# EAGLE design halogen-led (EAGLE 6.5.0)
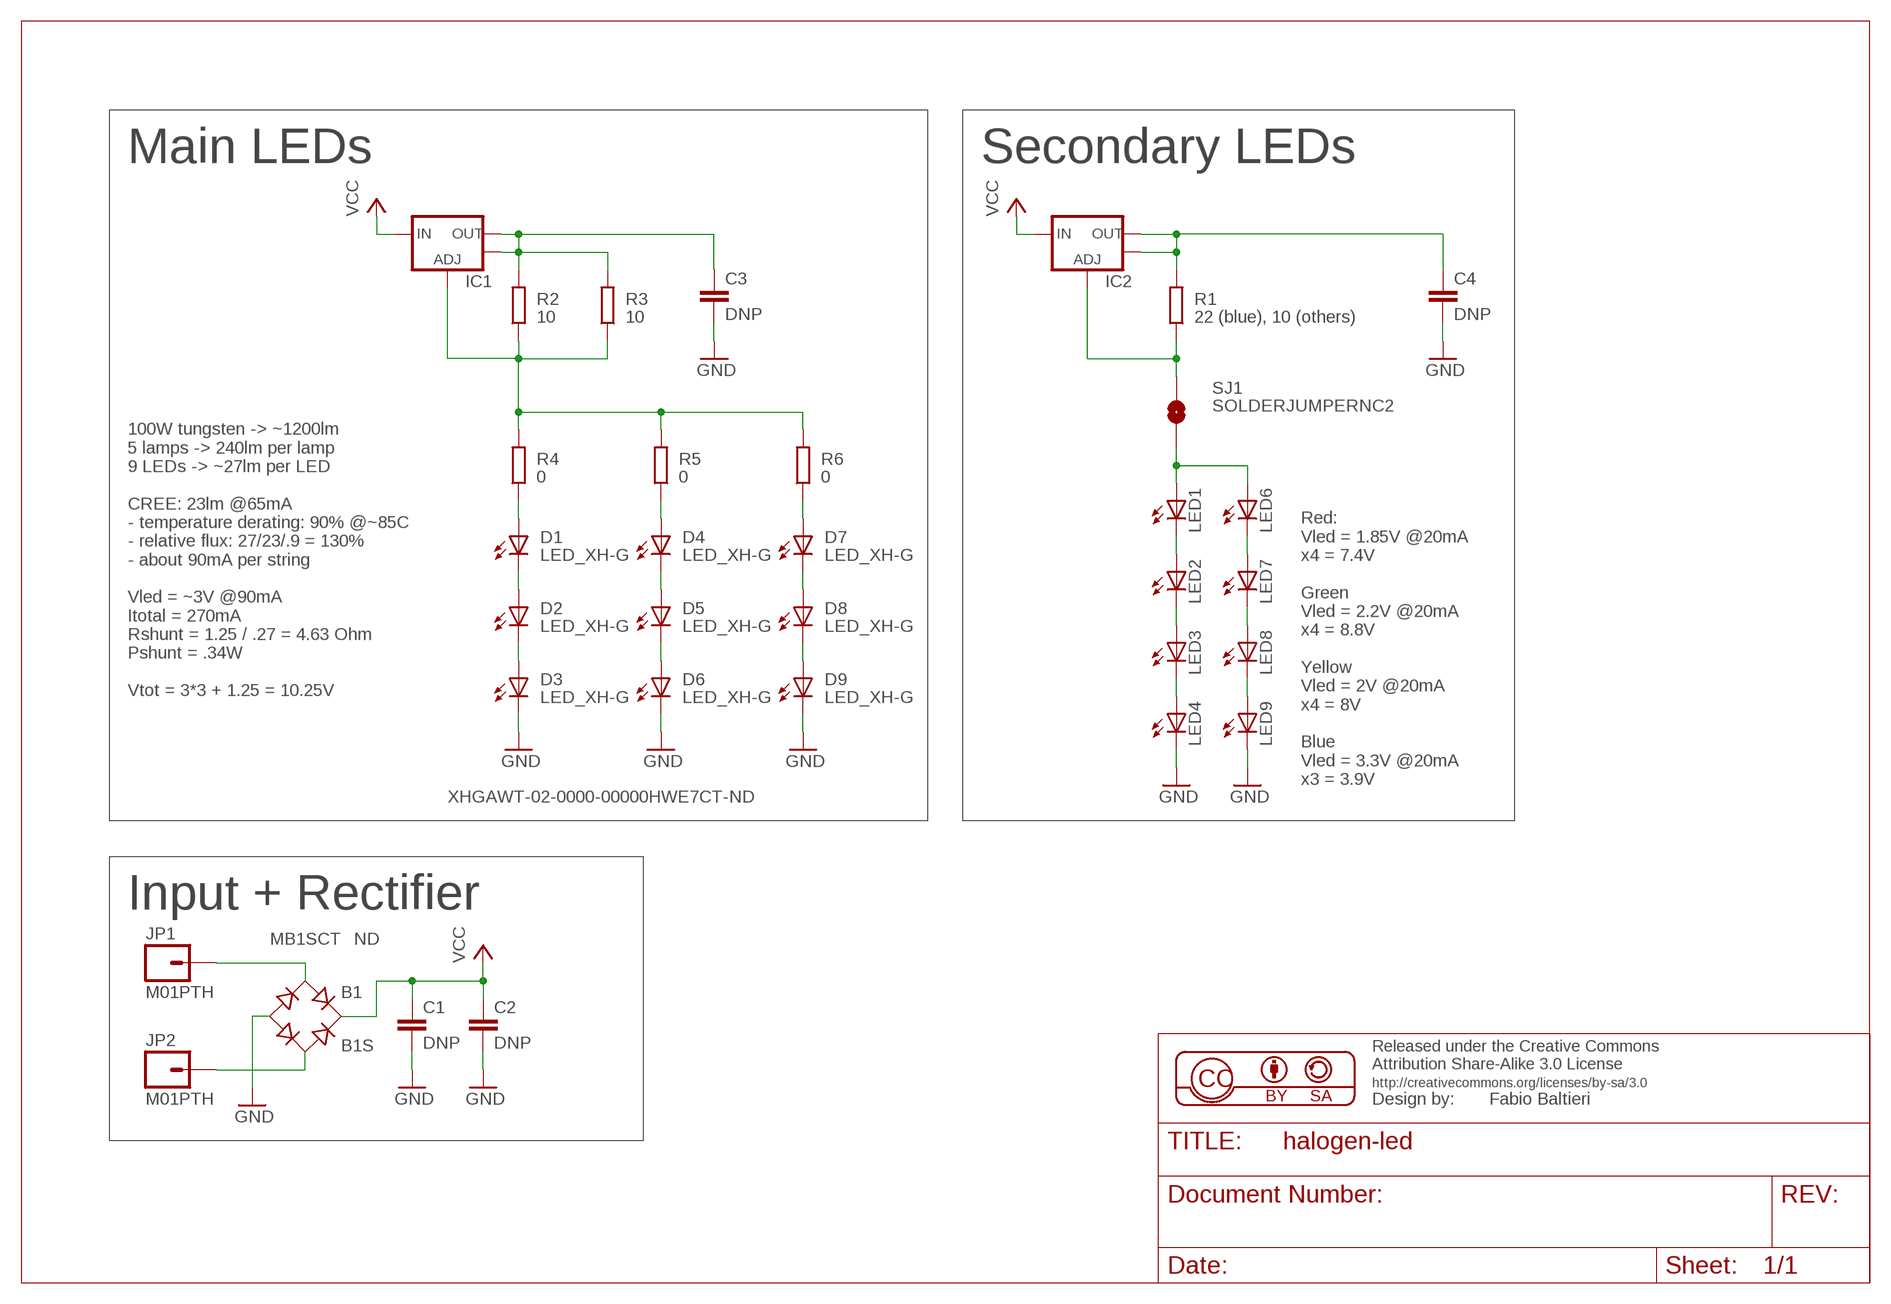
[diagram p0: schematic, sheet 1]

## Parts
B1  B1S  [MBS]
C1  DNP  C-EUC1206  [C1206]
C2  DNP  C-EUC1206  [C1206]
C3  DNP  C-EUC0805  [C0805]
C4  DNP  C-EUC0805  [C0805]
D1  LED_XH-G  [CREE_XHG]
D2  LED_XH-G  [CREE_XHG]
D3  LED_XH-G  [CREE_XHG]
D4  LED_XH-G  [CREE_XHG]
D5  LED_XH-G  [CREE_XHG]
D6  LED_XH-G  [CREE_XHG]
D7  LED_XH-G  [CREE_XHG]
D8  LED_XH-G  [CREE_XHG]
D9  LED_XH-G  [CREE_XHG]
IC1  V_REG_LM1117SOT223  [SOT223]
IC2  V_REG_LM1117SOT223  [SOT223]
JP1  M01PTH  [1X01]
JP2  M01PTH  [1X01]
LED1  LEDCHIPLED_0805  [CHIPLED_0805]
LED2  LEDCHIPLED_0805  [CHIPLED_0805]
LED3  LEDCHIPLED_0805  [CHIPLED_0805]
LED4  LEDCHIPLED_0805  [CHIPLED_0805]
LED6  LEDCHIPLED_0805  [CHIPLED_0805]
LED7  LEDCHIPLED_0805  [CHIPLED_0805]
LED8  LEDCHIPLED_0805  [CHIPLED_0805]
LED9  LEDCHIPLED_0805  [CHIPLED_0805]
R1  22 (blue), 10 (others)  R-EU_R1206  [R1206]
R2  10  R-EU_R1206  [R1206]
R3  10  R-EU_R1206  [R1206]
R4  0  R-EU_R0805  [R0805]
R5  0  R-EU_R0805  [R0805]
R6  0  R-EU_R0805  [R0805]
SJ1  SOLDERJUMPERNC2  [SJ_2S-NOTRACE]

## Nets
GND: B1.- C1.2 C2.2 C3.2 C4.2 D3.C D3.C@1(C) D6.C D6.C@1(C) D9.C D9.C@1(C) LED4.C LED9.C
N$1: B1.AC2 JP2.1
N$2: B1.AC1 JP1.1
N$3: C3.1 IC1.2(OUT) IC1.4(OUT) R2.2 R3.2
N$4: IC1.1(ADJ) R2.1 R3.1 R4.2 R5.2 R6.2
N$5: D1.A D1.A@1(A) R4.1
N$6: D4.A D4.A@1(A) R5.1
N$7: LED3.C LED4.A
N$8: LED2.C LED3.A
N$9: LED1.C LED2.A
N$10: LED1.A LED6.A SJ1.2
N$11: D2.C D2.C@1(C) D3.A D3.A@1(A)
N$12: D1.C D1.C@1(C) D2.A D2.A@1(A)
N$13: D5.C D5.C@1(C) D6.A D6.A@1(A)
N$14: D4.C D4.C@1(C) D5.A D5.A@1(A)
N$15: D8.C D8.C@1(C) D9.A D9.A@1(A)
N$16: C4.1 IC2.2(OUT) IC2.4(OUT) R1.2
N$17: D7.C D7.C@1(C) D8.A D8.A@1(A)
N$18: LED8.C LED9.A
N$19: LED7.C LED8.A
N$20: LED6.C LED7.A
N$21: D7.A D7.A@1(A) R6.1
N$23: IC2.1(ADJ) R1.1 SJ1.1
VCC: B1.+ C1.1 C2.1 IC1.3(IN) IC2.3(IN)

## Notes on the sheet
- Main LEDs | Secondary LEDs
- 100W tungsten -> ~1200lm
  5 lamps -> 240lm per lamp
  9 LEDs -> ~27lm per LED
  
  CREE: 23lm @65mA
  - temperature derating: 90% @~85C
  - relative flux: 27/23/.9 = 130%
  - about 90mA per string
  
  Vled = ~3V @90mA
  Itotal = 270mA
  Rshunt = 1.25 / .27 = 4.63 Ohm
  Pshunt = .34W
  
  Vtot = 3*3 + 1.25 = 10.25V
- Red:
  Vled = 1.85V @20mA
  x4 = 7.4V
  
  Green
  Vled = 2.2V @20mA
  x4 = 8.8V
  
  Yellow
  Vled = 2V @20mA
  x4 = 8V
  
  Blue
  Vled = 3.3V @20mA
  x3 = 3.9V
- XHGAWT-02-0000-00000HWE7CT-ND
- Input + Rectifier
- MB1SCT‑ND

## Library data of the parts
B1 = rectifier:B*S: Surface Mount Glass Passivated Bridge Rectifiers Source: Comchip Bridge Rectifiers B05S-G_B10S-G.pdf
C1-C4 = rcl:C-EU: CAPACITOR, European symbol
D1-D9 = balto:LED_XH-G: Cree XLamp XG-H LEDs
IC1 IC2 = SparkFun-PowerIC:V_REG_LM1117: Voltage Regulator LM1117 Standard adjustable voltage regulator but in SMD form. Spark Fun Electronics SKU : COM-00595
JP1 JP2 = SparkFun-Connectors:M01: Header 1 Standard 1-pin 0.1" header. Use with straight break away headers (SKU : PRT-00116), right angle break away headers (PRT-00553), swiss pins (PRT-00743), machine pins (PRT-00117), and female headers (PRT-00115).
LED1-LED4 LED6-LED9 = led:LED: LED OSRAM: - CHIPLED LG R971, LG N971, LY N971, LG Q971, LY Q971, LO R971, LY R971 LH N974, LH R974 LS Q976, LO Q976, LY Q976 LO Q996 - Hyper CHIPLED LW Q18S LB Q993, LB Q99A, LB R99A - SideLED LS A670, LO A670, LY A670, LG A670, LP A670 LB A673, LV A673, LT A673, LW A673 LH A674 LY A675 LS A676, LA A676, LO A676, LY A676, LW A676 LS A679, LY A679, LG A679 - Hyper Micro SIDELED® LS Y876, LA Y876, LO Y876, LY Y876 LT Y87S - SmartLED LW L88C, LW L88S LB L89C, LB L89S, LG L890 LS L89K, LO L89K, LY L89K LS L896, LA L896, LO L896, LY L896 - TOPLED LS T670, LO T670, LY T670, LG T670, LP T670 LSG T670, LSP T670, LSY T670, LOP T670, LYG T670 LG T671, LOG T671, LSG T671 LB T673, LV T673, LT T673, LW T673 LH T674 LS T676, LA T676, LO T676, LY T676, LB T676, LH T676, LSB T676, LW T676 LB T67C, LV T67C, LT T67C, LS T67K, LO T67K, LY T67K, LW E67C LS E67B, LA E67B, LO E67B, LY E67B, LB E67C, LV E67C, LT E67C LW T67C LS T679, LY T679, LG T679 LS T770, LO T770, LY T770, LG T770, LP T770 LB T773, LV T773, LT T773, LW T773 LH T774 LS E675, LA E675, LY E675, LS T675 LS T776, LA T776, LO T776, LY T776, LB T776 LHGB T686 LT T68C, LB T68C - Hyper Mini TOPLED® LB M676 - Mini TOPLED Santana® LG M470 LS M47K, LO M47K, LY M47K Source: http://www.osram.convergy.de LUXEON: - LUMILED® LXK2-PW12-R00, LXK2-PW12-S00, LXK2-PW14-U00, LXK2-PW14-V00 LXK2-PM12-R00, LXK2-PM12-S00, LXK2-PM14-U00 LXK2-PE12-Q00, LXK2-PE12-R00, LXK2-PE12-S00, LXK2-PE14-T00, LXK2-PE14-U00 LXK2-PB12-K00, LXK2-PB12-L00, LXK2-PB12-M00, LXK2-PB14-N00, LXK2-PB14-P00, LXK2-PB14-Q00 LXK2-PR12-L00, LXK2-PR12-M00, LXK2-PR14-Q00, LXK2-PR14-R00 LXK2-PD12-Q00, LXK2-PD12-R00, LXK2-PD12-S00 LXK2-PH12-R00, LXK2-PH12-S00 LXK2-PL12-P00, LXK2-PL12-Q00, LXK2-PL12-R00 Source: www.luxeon.com KINGBRIGHT: KA-3528ASYC Source: www.kingbright.com
R1-R6 = rcl:R-EU_: RESISTOR, European symbol
SJ1 = SparkFun-Passives:SOLDERJUMPER: Solder Jumper Standard SMD solder jumper. Used to automate production. Two varients : Normally Open and Normally Closed are the same, but have different paste layers. NC will have a large amount of paste and should jumper during reflow.

## Board
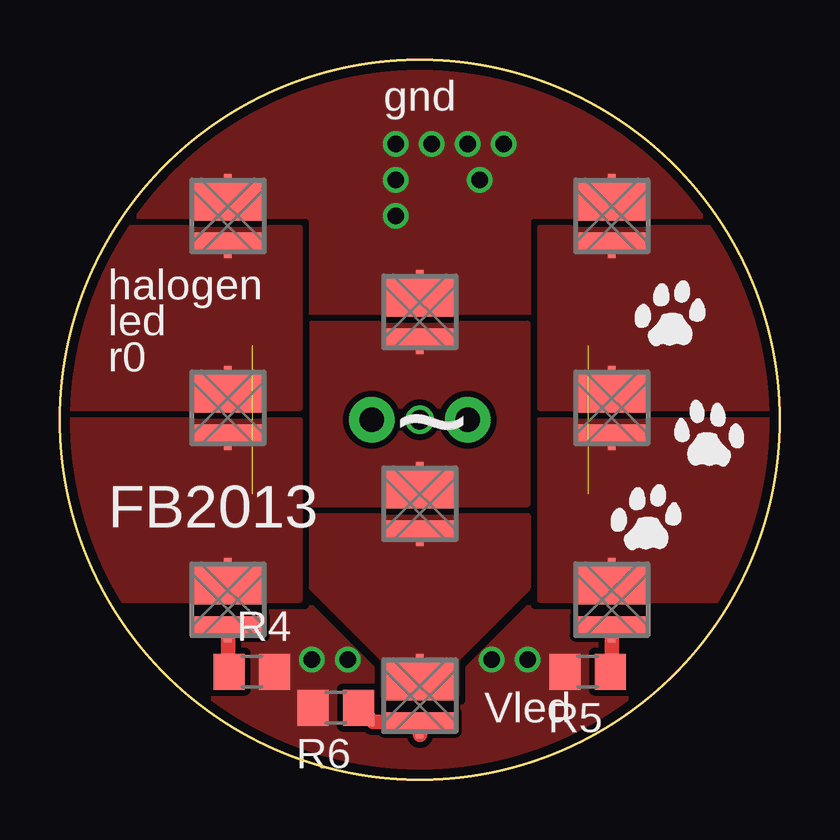
[diagram p1: board, top side]
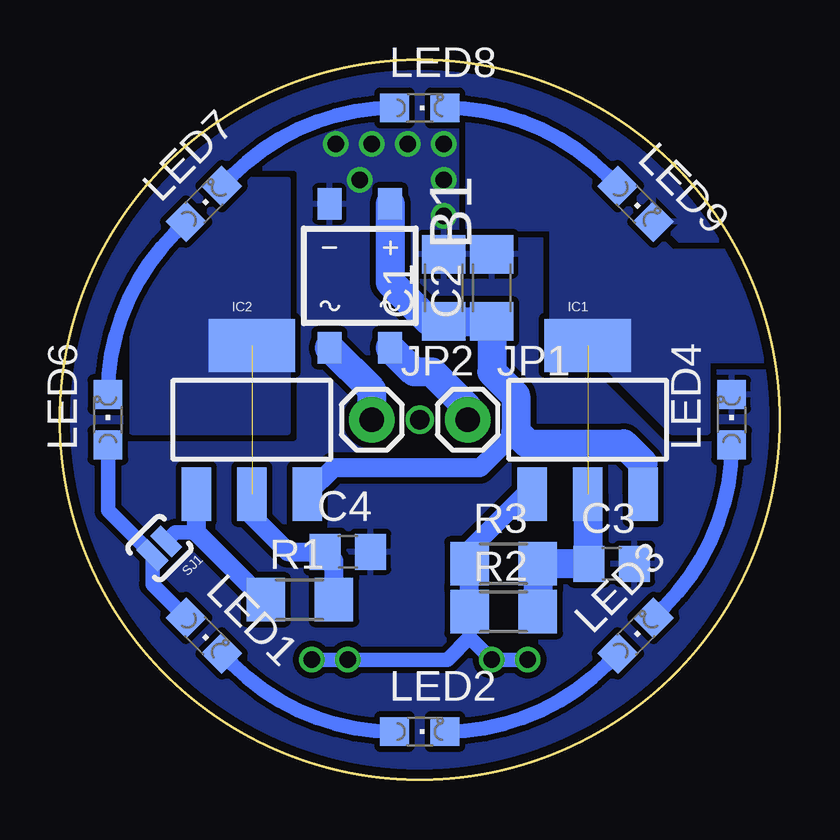
[diagram p2: board, bottom side, seen from below]

Size 30 x 30 mm. Coordinates in mm from the lower left corner, seen from the top.
Outline: circle at 15,15 radius 15
Copper layers (1*16): Top 0.035mm / dielectric 1.5mm / Bottom 0.035mm
Design rules "balto *": minimum track width 6mil, minimum drill 13mil, track to track 6mil, track to pad 6mil, pad to pad 6mil, via to via 6mil, smd to smd 6mil, copper to edge 15mil, drill to drill 6mil, minimum pad ring 7mil, minimum via ring 7mil, stop-mask expansion 2mil, vias tented up to drill 0.7mm, thermal gap 8mil

### Footprints (pad centres in the part's own frame; a part is rotated, then mirrored left to right if it is on the bottom)
MBS = smd 1 x 1.3: + -1.27,-3; - 1.27,-3; AC1 -1.27,3; AC2 1.27,3
C1206 = smd 1.6 x 1.8: 1 -1.4,0; 2 1.4,0
C0805 = smd 1.3 x 1.5: 1 -0.95,0; 2 0.95,0
CREE_XHG = smd 0.8 x 3: A 1.1,0 | smd 0.25 x 0.33: A@1 1.625,0; C@1 -1.625,0 | smd 1.7 x 3: C -0.65,0
SOT223 = smd 1.219 x 2.235: 1 -2.311,-3.099; 2 0,-3.099; 3 2.311,-3.099 | smd 3.6 x 2.2: 4 0,3.099
1X01 = drill 1.016 pad 1.88: 1 0,0
CHIPLED_0805 = smd 1.2 x 1.2: A 0,-1.05; C 0,1.05
R1206 = smd 1.6 x 1.803: 1 -1.422,0; 2 1.422,0
R0805 = smd 1.3 x 1.5: 1 -0.95,0; 2 0.95,0
SJ_2S-NOTRACE = smd 0.635 x 1.27: 1 -0.401,0; 2 0.413,0

### Placement (x,y rotation side)
B1  17.5,21 180 bottom
C1  14,20.5 90 bottom
C2  12,20.5 90 bottom
C3  7,9 0 bottom
C4  18,9.5 0 bottom
D1  7,7.5 270 top
D2  7,15.5 270 top
D3  7,23.5 270 top
D4  23,7.5 270 top
D5  23,15.5 270 top
D6  23,23.5 270 top
D7  15,3.5 270 top
D8  15,11.5 270 top
D9  15,19.5 270 top
IC1  8,15 0 bottom
IC2  22,15 0 bottom
JP1  13,15 0 bottom
JP2  17,15 0 bottom
LED1  24,6 225 bottom
LED2  15,2 270 bottom
LED3  6,6 315 bottom
LED4  2,15 0 bottom
LED6  28,15 0 bottom
LED7  24,24 315 bottom
LED8  15,28 270 bottom
LED9  6,24 225 bottom
R1  20,7.5 0 bottom
R2  11.5,7 0 bottom
R3  11.5,9 0 bottom
R4  8,4.5 0 top
R5  22,4.5 180 top
R6  11.5,3 180 top
SJ1  25.85,9.65 225 bottom
U$1  [CAT-R]  27,14 0 top
U$2  [CAT-L]  24.5,10.5 0 top
U$3  [CAT-L]  25.5,19 0 top

### Tracks (layer width: path | path; a pad name or v marks a point on that pad's centre or on a via)
GND  (via drill 0.7)
  other vias: 14,26.5 14,25 15.5,26.5 17,26.5 18.5,26.5 14,23.5 17.5,25
  pour Bottom (isolate 0.254, rank 2): 0,0 30,0 30,30 0,30
  pour Top (isolate 0.254, rank 5, no thermals): -1.5,19.5 31.5,19.5 31.5,30 -1.5,30
N$1
  Bottom 1.2: JP2.1 17,16.23 B1.AC2
N$2
  Bottom 1.2: JP1.1 13,15.5 14.5,17 15.23,17 B1.AC1
N$3  (1 unrouted)
  Bottom 1.2: IC1.2 8,9.05 C3.1 R3.2 R2.2
  pour Bottom (isolate 0.254, no thermals): 0.5,22 4.5,22 9.5,27 10.5,27 11,27.5 13,27.5 13,23 9.5,23 9.5,17.5 7.5,17.5 4.5,14.5 3,14.5 3,17.5 0.5,17.5
N$4  (via drill 0.7)
  Bottom 0.6: R2.1 12.92,5.92 | 12.92,5.92 v12,5 v10.5,5 | 12.92,5.92 13.84,5 v18,5 v19.5,5
  Bottom 0.8: IC1.1 10.6,11.9 12.92,9.58 R3.1 R2.1
  pour Top (isolate 0.254, rank 5, no thermals): 0,7.5 30,7.5 30,0 0,0
N$5
  Top 0.6: D1.A D1.A@1 7,4.55 R4.1
N$6
  Top 0.6: D4.A D4.A@1 23,4.55 R5.1
N$7
  Bottom 0.6: LED3.C 4.79,7.21 arc-45 LED4.A
N$8
  Bottom 0.6: LED2.C arc-45 7.21,4.79 LED3.A
N$9
  Bottom 0.6: LED1.C 22.79,4.79 arc-45 LED2.A
N$10
  Bottom 0.61: LED6.A 28,11.21 SJ1.2 26.14,8.14 LED1.A
N$11
  pour Top (isolate 0.254, rank 3, no thermals): -1,15.5 10,15.5 10,23 -1,23
N$12
  pour Top (isolate 0.254, rank 4, no thermals): -0.5,7.5 10,7.5 10,15 -0.5,15
N$13
  pour Top (isolate 0.254, rank 3, no thermals): 20,15.5 31,15.5 31,23 20,23
N$14
  pour Top (isolate 0.254, rank 4, no thermals): 20,7.5 30.5,7.5 30.5,15 20,15
N$15
  pour Top (isolate 0.254, rank 3, no thermals): 10.5,11.5 19.5,11.5 19.5,19 10.5,19
N$16  (1 unrouted)
  Bottom 0.8: IC2.2 22,11 20.5,9.5 C4.1 18.58,9.13 R1.2
  pour Bottom (isolate 0.254, no thermals): 20.5,14.5 20.5,25 22.5,25 27,20.5 27,14.5
N$17
  pour Top (isolate 0.254, rank 4, no thermals): 10.5,11 19.5,11 19.5,8 16.5,5 16.5,3.5 13.5,3.5 13.5,5 10.5,8
N$18
  Bottom 0.6: LED8.C arc45 7.21,25.21 LED9.A
N$19
  Bottom 0.6: LED7.C 22.79,25.21 arc45 LED8.A
N$20
  Bottom 0.6: LED6.C arc45 25.21,22.79 LED7.A
N$21
  Top 0.6: R6.1 13.05,2.4 D7.A D7.A@1
N$22  (via drill 0.8)
  other vias: 15,15
N$23
  Bottom 0.61: 24.31,10.31 25.19,10.31 SJ1.1
  Bottom 0.8: R1.1 21.5,7.5 24.31,10.31 IC2.1
VCC
  Bottom 0.8: 11,14.5 12.5,13 18.59,13 IC2.3
  Bottom 1.2: IC1.3 5.69,13.19 6.5,14 10.5,14 11,14.5 11,16 12,17 C2.1 C1.1 14.6,19.1 16.23,20.73 B1.+

### Text on the board
_tsilk: gnd | halogen | led | r0 | ~ | FB2013 | Vled